# Altium schematic sheet Sheet1.SchDoc
size A4
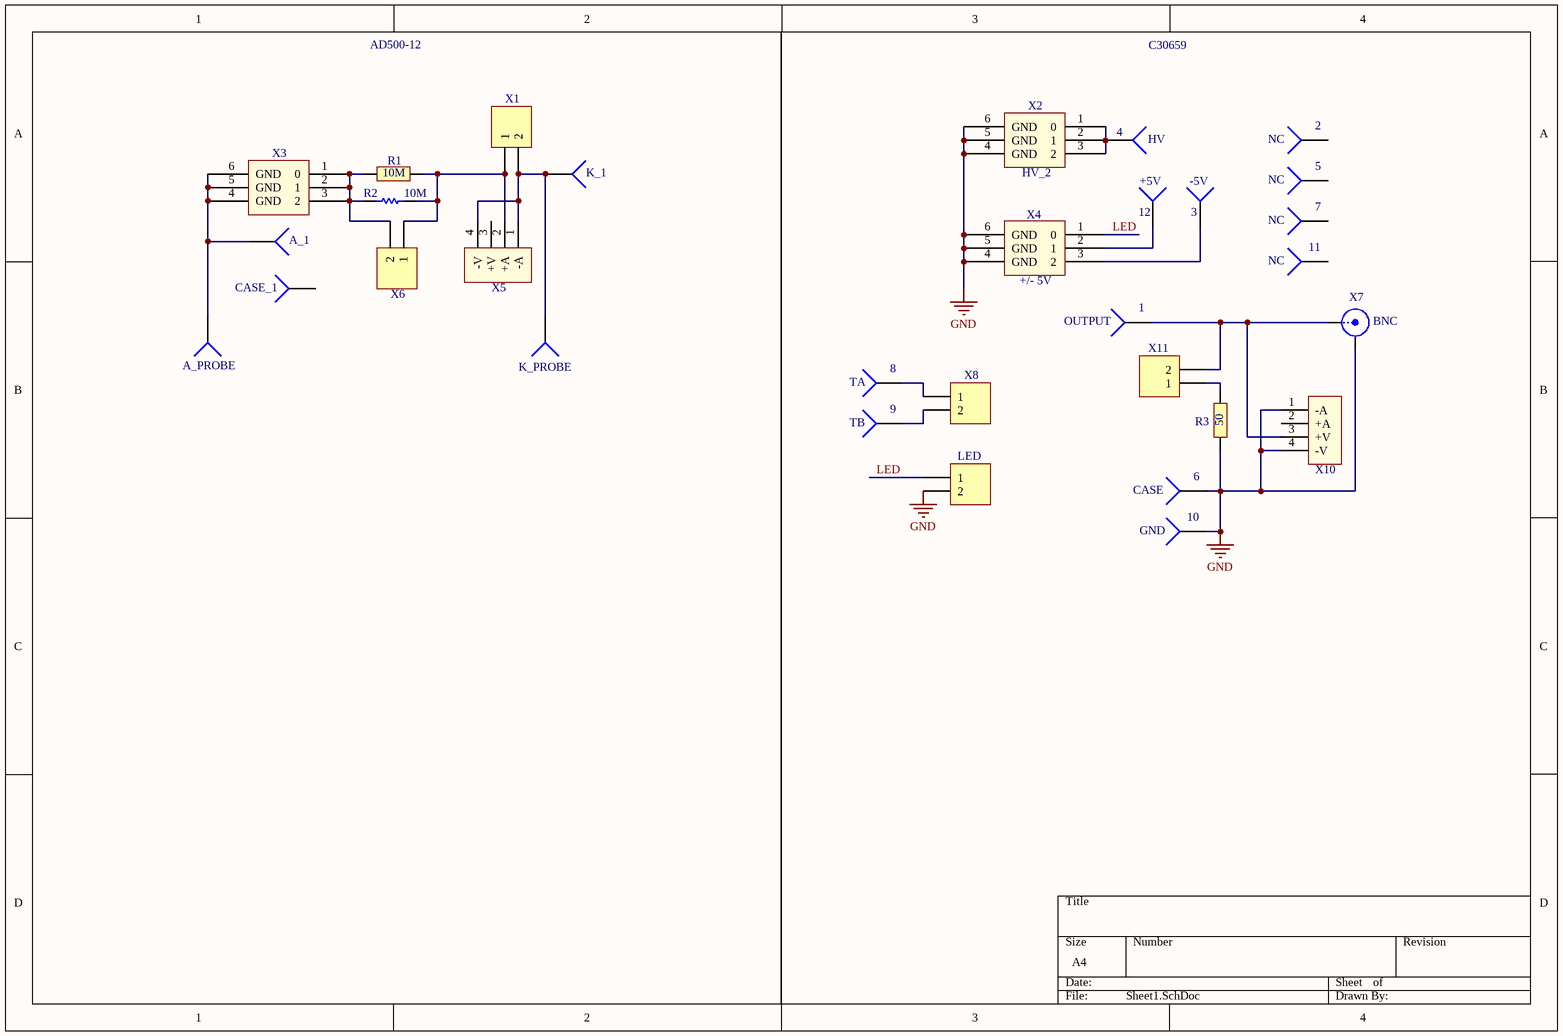
[diagram p0: Sheet1.SchDoc]

## Parts
1  OUTPUT  [PIN1]
2  NC  [PIN1]
3  -5V  [PIN1]
4  HV  [PIN1]
5  NC  [PIN1]
6  CASE  [PIN1]
7  NC  [PIN1]
8  TA  [PIN1]
9  TB  [PIN1]
10  GND  [PIN1]
11  NC  [PIN1]
12  +5V  [PIN1]
A_1  Socket  [PIN1]  (value not drawn)
A_PROBE  Socket  [PIN1]  (value not drawn)
CASE_1  Socket  [PIN1]  (value not drawn)
K_1  Socket  [PIN1]  (value not drawn)
K_PROBE  Socket  [PIN1]  (value not drawn)
LED  Header 2  [HDR1X2]  (value not drawn)
R1  10M  [RES]
R2  value 10M  [AXIAL-0.3]  (hidden comment: Res1)
R3  50  [RES]
X1  Header 2  [HDR1X2]  (value not drawn)
X2  HV_2  [POWER]
X3  POWER  [POWER]  (value not drawn)
X4  +/- 5V  [POWER]
X5  AMPVOLT  [AMP_VOLTMETER]  (value not drawn)
X6  Header 2  [HDR1X2]  (value not drawn)
X7  BNC  [BNC_RA CON]
X8  Header 2  [HDR1X2]  (value not drawn)
X10  AMPVOLT  [AMP_VOLTMETER]  (value not drawn)
X11  Header 2  [HDR1X2]  (value not drawn)

## Nets
GND: 6.1 10.1 LED.2 R3.1 X2.4(GND) X2.5(GND) X2.6(GND) X4.4(GND) X4.5(GND) X4.6(GND) X7.2(Y) X10.1(-A) X10.4(-V)
LED: LED.1 X4.1(0)
Net1_1: 1.1 X7.1(X) X10.3(+V) X11.2
Net3_1: 3.1 X4.3(2)
Net4_1: 4.1 X2.1(0) X2.2(1) X2.3(2)
Net8_1: 8.1 X8.1
Net9_1: 9.1 X8.2
Net12_1: 12.1 X4.2(1)
NetA_1_1: A_1.1 A_PROBE.1 X3.4(GND) X3.5(GND) X3.6(GND)
NetK_1_1: K_1.1 K_PROBE.1 X1.2 X5.1(-A) X5.4(-V)
NetR1_1: R1.1 R2.1 X3.1(0) X3.2(1) X3.3(2) X6.2
NetR1_2: R1.2 R2.2 X1.1 X5.2(+A) X6.1
NetR3_2: R3.2 X11.1

Not connected (* = marked no-connect by the designer): 2 1; 5 1; 7 1; 11 1; CASE_1 1; X5 3(+V); X10 2(+A)

## Notes on the sheet
- AD500-12
- C30659

## Library data of the parts
1-12 = Socket: LatestRevisionDate: 17-Jul-2002; LatestRevisionNote: Re-released for DXP Platform.; Publisher: Altium Limited
LED X1 X6 X8 X11 = Header 2: Header, 2-Pin; LatestRevisionDate: 17-Jul-2002; LatestRevisionNote: Re-released for DXP Platform.; Publisher: Altium Limited
R1 R3 = RES
R2 = Res1: Resistor; Published: 8-Jun-2000; LatestRevisionDate: 17-Jul-2002; LatestRevisionNote: Re-released for DXP Platform.; PackageReference: AXIAL-0.3; Publisher: Altium Limited; PackageDescription: Axial Device, Thru-Hole; 2 Leads; 0.3 in Pin Spacing
X2 X4 = POWER
X5 X10 = AMP_VOLTMETER
X7 = BNC: BNC Elbow Connector; LatestRevisionDate: 17-Jul-2002; LatestRevisionNote: Re-released for DXP Platform.; Publisher: Altium Limited
A_1 A_PROBE CASE_1 K_1 K_PROBE = Socket: LatestRevisionDate: 17-Jul-2002; LatestRevisionNote: Re-released for DXP Platform.; Publisher: Altium Limited